# EAGLE design RFM12-Breakout (EAGLE 5.06)
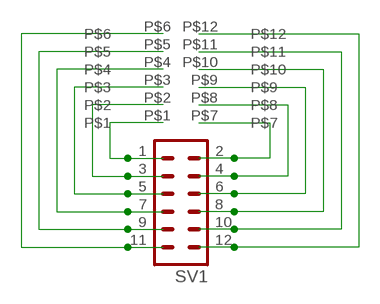
[diagram p0: schematic, sheet 1]

## Parts
CONN1  55510-112TRLF  [SMDVERT12]
SV1  MA06-2  [MA06-2]

## Nets
N$1: CONN1.P$1 SV1.1
N$2: CONN1.P$2 SV1.3
N$3: CONN1.P$3 SV1.5
N$4: CONN1.P$4 SV1.7
N$5: CONN1.P$5 SV1.9
N$6: CONN1.P$6 SV1.11
N$7: CONN1.P$7 SV1.2
N$8: CONN1.P$8 SV1.4
N$9: CONN1.P$9 SV1.6
N$10: CONN1.P$10 SV1.8
N$11: CONN1.P$11 SV1.10
N$12: CONN1.P$12 SV1.12

## Library data of the parts
CONN1 = Jb-components:55510-112TRLF: CONN RECEPT 12POS 2MM STR DL SMD
SV1 = con-lstb:MA06-2: PIN HEADER

## Board
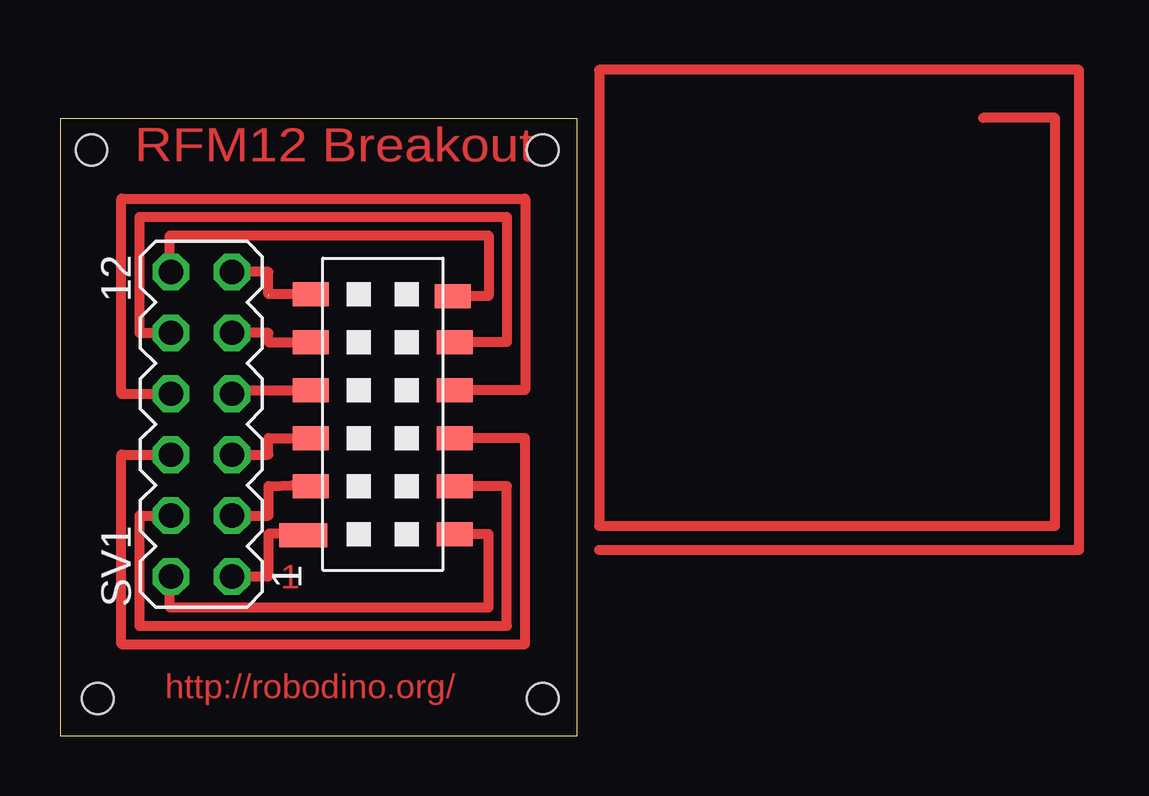
[diagram p1: board, top side]

Size 21.56 x 25.7 mm. Coordinates in mm from the lower left corner, seen from the top.
Outline: 0,0 21.56,0 21.56,25.7 0,25.7 0,0
Copper layers (1*16): Top 0.035mm / dielectric 1.5mm / Bottom 0.035mm
Design rules "default *": minimum track width 10mil, minimum drill 24mil, track to track 10mil, track to pad 10mil, pad to pad 10mil, via to via 10mil, smd to smd 10mil, copper to edge 40mil, drill to drill 8mil, minimum pad ring 10mil, minimum via ring 8mil, stop-mask expansion 4mil, vias tented up to drill 0mil, thermal gap 10mil
Holes 1.3 mm at 1.57,1.54 20.11,1.54 20.11,24.4 1.32,24.4

### Footprints (pad centres in the part's own frame; a part is rotated, then mirrored left to right if it is on the bottom)
SMDVERT12 = smd 2 x 1: P$1 -13.81,0.46 | smd 1.5 x 1: P$2 -13.5,2.5; P$3 -13.5,4.5; P$4 -13.5,6.5; P$5 -13.5,8.5; P$6 -13.5,10.5; P$7 -7.5,0.5; P$8 -7.5,2.5; P$9 -7.5,4.5; P$10 -7.5,6.5; P$11 -7.5,8.5; P$12 -7.58,10.42
MA06-2 = drill 1.016 octagon: 1 -6.35,-1.27; 2 -6.35,1.27; 3 -3.81,-1.27; 4 -3.81,1.27; 5 -1.27,-1.27; 6 -1.27,1.27; 7 1.27,-1.27; 8 1.27,1.27; 9 3.81,-1.27; 10 3.81,1.27; 11 6.35,-1.27; 12 6.35,1.27

### Placement (x,y rotation side)
CONN1  23.95,7.89 0 top
SV1  5.89,12.97 90 top

### Tracks (layer width: path | path; a pad name or v marks a point on that pad's centre or on a via)
N$1
  Top 0.406: 9.7,8.35 9.45,8.35 9.45,8.4 8.68,8.4 8.68,6.62 SV1.1
  Top 0.61: CONN1.P$1 9.7,8.35
N$2
  Top 0.254: 8.69,10.39 CONN1.P$2
  Top 0.406: 9.7,10.43 8.69,10.39 8.69,9.16 SV1.3
N$3
  Top 0.406: CONN1.P$3 8.68,12.39 8.68,11.7 SV1.5
N$4
  Top 0.406: 7.16,14.39 CONN1.P$4
  Top 1.016: SV1.7 7.16,14.39
N$5
  Top 0.406: CONN1.P$5 8.68,16.39 8.68,16.78 SV1.9
N$6  (1 unrouted)
  Top 0.406: CONN1.P$6 8.68,18.39 8.68,19.32 SV1.11
N$7
  Top 0.406: CONN1.P$7 17.86,8.39 17.86,5.33 4.58,5.33 4.58,6.62
  Top 0.61: 4.58,6.62 SV1.2
N$8
  Top 0.406: CONN1.P$8 18.62,10.39 18.62,4.57 3.32,4.57 3.32,9.16 SV1.4
N$9
  Top 0.406: CONN1.P$9 19.38,12.39 19.38,3.81 2.56,3.81 2.56,11.7 SV1.6
N$10
  Top 0.406: CONN1.P$10 19.38,14.39 19.38,22.37 2.56,22.37 2.56,14.24 SV1.8
N$11
  Top 0.406: CONN1.P$11 18.62,16.39 18.62,21.61 3.32,21.61 3.32,16.78 SV1.10
N$12
  Top 0.406: CONN1.P$12 17.86,18.31 17.86,20.84 4.58,20.84 4.58,19.32
  Top 0.61: 4.58,19.32 SV1.12
N$13
  Top 0.406: 22.46,7.74 42.46,7.74 42.46,27.74 22.46,27.74 22.46,8.74 41.46,8.74 41.46,25.74 38.46,25.74

### Text on the board
Top: RFM12 Breakout | 1 | http://robodino.org/